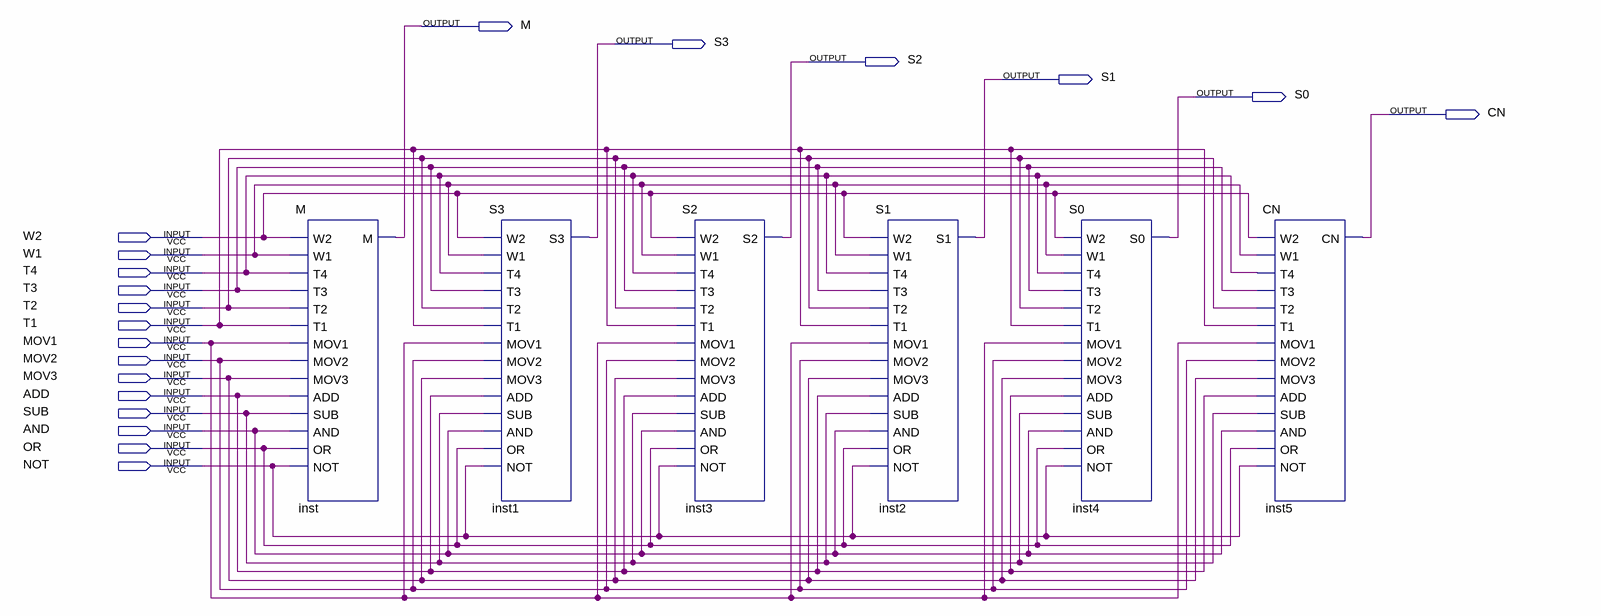
[diagram p0: schematic sheet]
// Quartus schematic PREALU.bdf as structural Verilog: 6 symbols, 20 pins
module PREALU (
  input  W2,
  input  W1,
  input  T4,
  input  T3,
  input  T2,
  input  T1,
  input  MOV1,
  input  MOV2,
  input  MOV3,
  input  ADD,
  input  SUB,
  input  AND,
  input  OR,
  input  NOT,
  output M,
  output S3,
  output S2,
  output S1,
  output S0,
  output CN
);

  M inst (
    .W2(W2), .W1(W1), .T4(T4), .T3(T3), .T2(T2), .T1(T1), .MOV1(MOV1), .MOV2(MOV2), .MOV3(MOV3), .ADD(ADD),
    .SUB(SUB), .AND(AND), .OR(OR), .NOT(NOT), .M(M));
  S3 inst1 (
    .W2(W2), .W1(W1), .T4(T4), .T3(T3), .T2(T2), .T1(T1), .MOV1(MOV1), .MOV2(MOV2), .MOV3(MOV3), .ADD(ADD),
    .SUB(SUB), .AND(AND), .OR(OR), .NOT(NOT), .S3(S3));
  S2 inst3 (
    .W2(W2), .W1(W1), .T4(T4), .T3(T3), .T2(T2), .T1(T1), .MOV1(MOV1), .MOV2(MOV2), .MOV3(MOV3), .ADD(ADD),
    .SUB(SUB), .AND(AND), .OR(OR), .NOT(NOT), .S2(S2));
  S1 inst2 (
    .W2(W2), .W1(W1), .T4(T4), .T3(T3), .T2(T2), .T1(T1), .MOV1(MOV1), .MOV2(MOV2), .MOV3(MOV3), .ADD(ADD),
    .SUB(SUB), .AND(AND), .OR(OR), .NOT(NOT), .S1(S1));
  S0 inst4 (
    .W2(W2), .W1(W1), .T4(T4), .T3(T3), .T2(T2), .T1(T1), .MOV1(MOV1), .MOV2(MOV2), .MOV3(MOV3), .ADD(ADD),
    .SUB(SUB), .AND(AND), .OR(OR), .NOT(NOT), .S0(S0));
  CN inst5 (
    .W2(W2), .W1(W1), .T4(T4), .T3(T3), .T2(T2), .T1(T1), .MOV1(MOV1), .MOV2(MOV2), .MOV3(MOV3), .ADD(ADD),
    .SUB(SUB), .AND(AND), .OR(OR), .NOT(NOT), .CN(CN));
endmodule
